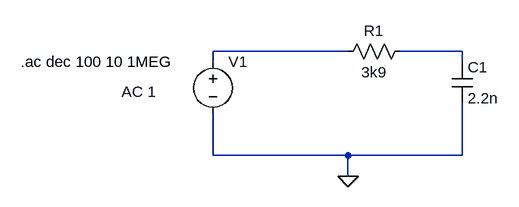
[diagram p0: schematic Ejercicio 1 - Pasabajo.asc]
Ejercicio 1 - Pasabajo.asc, the LTspice schematic file:
Version 4
SHEET 1 880 680
WIRE 128 112 -80 112
WIRE 304 112 208 112
WIRE -80 128 -80 112
WIRE 304 128 304 112
WIRE -80 272 -80 208
WIRE 128 272 -80 272
WIRE 304 272 304 192
WIRE 304 272 128 272
WIRE 128 304 128 272
FLAG 128 304 0
SYMBOL res 224 96 R90
WINDOW 0 0 56 VBottom 2
WINDOW 3 32 56 VTop 2
SYMATTR InstName R1
SYMATTR Value 3k9
SYMBOL cap 288 128 R0
SYMATTR InstName C1
SYMATTR Value 2.2n
SYMBOL voltage -80 112 R0
WINDOW 123 -141 62 Left 2
WINDOW 39 0 0 Left 0
SYMATTR Value2 AC 1
SYMATTR InstName V1
SYMATTR Value ""
TEXT -376 128 Left 2 !.ac dec 100 10 1MEG

The netlist it stands for:
* Ejercicio 1 - Pasabajo.asc
R1 N002 N001 3k9
C1 N002 0 2.2n
V1 N001 0 AC 1
.ac dec 100 10 1MEG
.backanno
.end